# Altium project FallDetection.PrjPcb
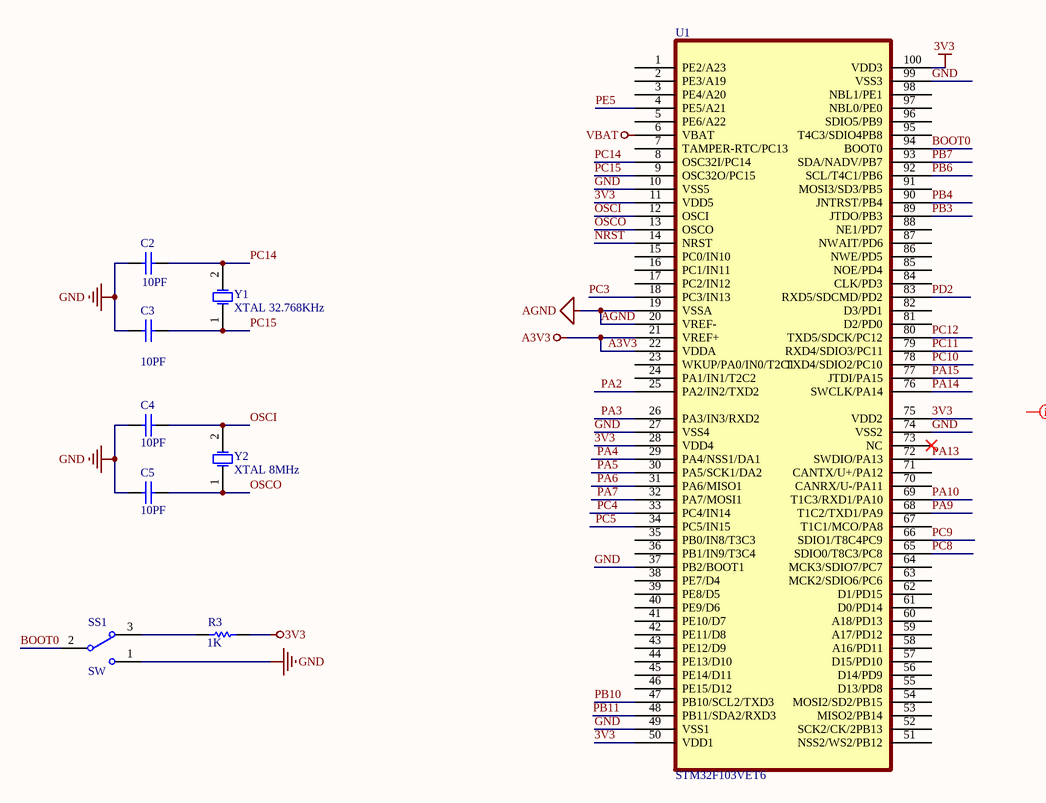
[diagram p0: FallDetection.SchDoc]
4 sheets, 60 parts. Net scope: global (net labels, ports and power ports of the same name join across sheets).
Board file: FallDetection.PcbDoc
Sheets:
  FallDetection.SchDoc
  power.SchDoc
  periphrial.SchDoc
  storage.SchDoc

## Sheet FallDetection.SchDoc: 跌倒检测
size A4

### Parts
C2  10PF  [1608[0603]]
C3  10PF  [1608[0603]]
C4  10PF  [1608[0603]]
C5  10PF  [1608[0603]]
R3  value 1K  [J1-0603]  (hidden comment: Res1)
SS1  SW  [SS-12F44]
U1  STM32F103VET6  [TQFP100-2]
Y1  XTAL 32.768KHz  [XTAL2]
Y2  XTAL 8MHz  [XTAL1]

### Nets
3V3: R3.2 U1.11(VDD5) U1.28(VDD4) U1.50(VDD1) U1.75(VDD2) U1.100(VDD3)
A3V3: U1.21(VREF+) U1.22(VDDA)
AGND: U1.19(VSSA) U1.20(VREF-)
GND: C2.2 C3.2 C4.2 C5.2 SS1.1 U1.10(VSS5) U1.27(VSS4) U1.37(PB2/BOOT1) U1.49(VSS1) U1.74(VSS2) U1.99(VSS3)
VBAT: U1.6(VBAT)
BOOT0: SS1.2 U1.94(BOOT0)
NRST: U1.14(NRST)
OSCI: C4.1 U1.12(OSCI) Y2.2(OSC2)
OSCO: C5.1 U1.13(OSCO) Y2.1(OSC1)
PA2: U1.25(PA2/IN2/TXD2)
PA3: U1.26(PA3/IN3/RXD2)
PA4: U1.29(PA4/NSS1/DA1)
PA5: U1.30(PA5/SCK1/DA2)
PA6: U1.31(PA6/MISO1)
PA7: U1.32(PA7/MOSI1)
PA9: U1.68(T1C2/TXD1/PA9)
PA10: U1.69(T1C3/RXD1/PA10)
PA13: U1.72(SWDIO/PA13)
PA14: U1.76(SWCLK/PA14)
PA15: U1.77(JTDI/PA15)
PB3: U1.89(JTDO/PB3)
PB4: U1.90(JNTRST/PB4)
PB6: U1.92(SCL/T4C1/PB6)
PB7: U1.93(SDA/NADV/PB7)
PB10: U1.47(PB10/SCL2/TXD3)
PB11: U1.48(PB11/SDA2/RXD3)
PC3: U1.18(PC3/IN13)
PC4: U1.33(PC4/IN14)
PC5: U1.34(PC5/IN15)
PC8: U1.65(SDIO0/T8C3/PC8)
PC9: U1.66(SDIO1/T8C4PC9)
PC10: U1.78(TXD4/SDIO2/PC10)
PC11: U1.79(RXD4/SDIO3/PC11)
PC12: U1.80(TXD5/SDCK/PC12)
PC14: C2.1 U1.8(OSC32I/PC14) Y1.2(OSC2)
PC15: C3.1 U1.9(OSC32O/PC15) Y1.1(OSC1)
PD2: U1.83(RXD5/SDCMD/PD2)
PE5: U1.4(PE5/A21)
NetR3_1: R3.1 SS1.3

Not connected (* = marked no-connect by the designer): U1 1(PE2/A23) 2(PE3/A19) 3(PE4/A20) 5(PE6/A22) 7(TAMPER-RTC/PC13) 15(PC0/IN10) 16(PC1/IN11) 17(PC2/IN12) 23(WKUP/PA0/IN0/T2C1) 24(PA1/IN1/T2C2) 35(PB0/IN8/T3C3) 36(PB1/IN9/T3C4) 38(PE7/D4) 39(PE8/D5) 40(PE9/D6) 41(PE10/D7) 42(PE11/D8) 43(PE12/D9) 44(PE13/D10) 45(PE14/D11) 46(PE15/D12) 51(NSS2/WS2/PB12) 52(SCK2/CK/2PB13) 53(MISO2/PB14) 54(MOSI2/SD2/PB15) 55(D13/PD8) 56(D14/PD9) 57(D15/PD10) 58(A16/PD11) 59(A17/PD12) 60(A18/PD13) 61(D0/PD14) 62(D1/PD15) 63(MCK2/SDIO6/PC6) 64(MCK3/SDIO7/PC7) 67(T1C1/MCO/PA8) 70(CANRX/U-/PA11) 71(CANTX/U+/PA12) 73(NC)* 81(D2/PD0) 82(D3/PD1) 84(CLK/PD3) 85(NOE/PD4) 86(NWE/PD5) 87(NWAIT/PD6) 88(NE1/PD7) 91(MOSI3/SD3/PB5) 95(T4C3/SDIO4PB8) 96(SDIO5/PB9) 97(NBL0/PE0) 98(NBL1/PE1)

### Layout directives
net class CPU: (no net found under the mark)

### Notes on the sheet
- Title
- Size:
- Date:
- A4
- Number:
- Time:
- Revision:
- Sheet
- of
- File:

### Library data of the parts
C2 C3 = Cap: Capacitor; Published: 8-Jun-2000; LatestRevisionDate: 17-Jul-2002; LatestRevisionNote: Re-released for DXP Platform.; PackageReference: RAD-0.3; Publisher: Altium Limited; Value: 10PF
C4 C5 = Cap: Capacitor; Value: 0.01uF; Published: 8-Jun-2000; LatestRevisionDate: 17-Jul-2002; LatestRevisionNote: Re-released for DXP Platform.; PackageReference: RAD-0.3; Publisher: Altium Limited
R3 = Res1: Resistor; Published: 8-Jun-2000; LatestRevisionDate: 17-Jul-2002; LatestRevisionNote: Re-released for DXP Platform.; PackageReference: AXIAL-0.3; Publisher: Altium Limited; PackageDescription: Axial Device, Thru-Hole; 2 Leads; 0.3 in Pin Spacing
SS1 = SS-12F44: 拨动开关 SS-12F44 二挡立式 1P2T SS12F44G5 滑动开关
U1 = STM32F103VET6: ST High-density performance line ARM-based 32-bit MCU with 256 to  512KB Flash, USB, CAN, 11 timers, 3 ADCs, 13 communication interfaces
Y1 Y2 = XTAL: Crystal Oscillator; Published: 8-Jun-2000; LatestRevisionDate: 17-Jul-2002; LatestRevisionNote: Re-released for DXP Platform.; PackageReference: R38; Publisher: Altium Limited

## Sheet power.SchDoc
size A4
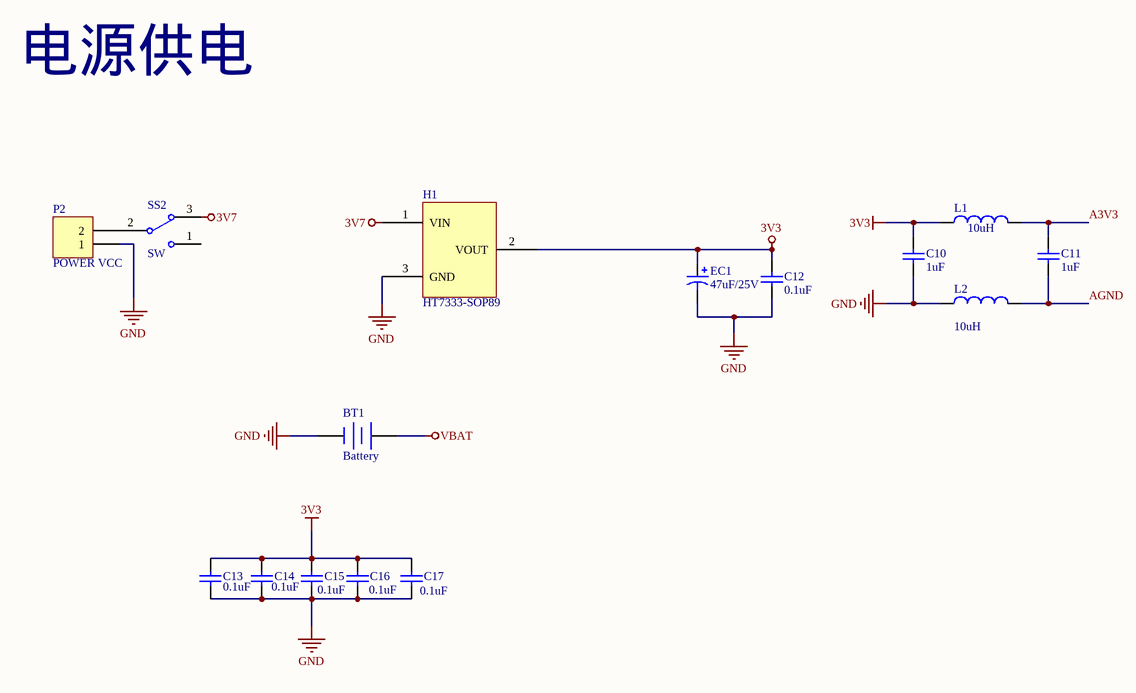
[diagram p1: power.SchDoc]

### Parts
BT1  Battery  [CR1220]
C10  1uF  [1608[0603]]
C11  1uF  [1608[0603]]
C12  value 0.1uF  [1608[0603]]  (hidden comment: Cap)
C13  value 0.1uF  [1608[0603]]  (hidden comment: Cap)
C14  value 0.1uF  [1608[0603]]  (hidden comment: Cap)
C15  value 0.1uF  [1608[0603]]  (hidden comment: Cap)
C16  value 0.1uF  [1608[0603]]  (hidden comment: Cap)
C17  value 0.1uF  [1608[0603]]  (hidden comment: Cap)
EC1  47uF/25V  [47UF 25V SMT Caps]
H1  HT7333-SOP89  [HT7333-SOT89]
L1  10uH  [0805C]
L2  10uH  [0805C]
P2  POWER VCC  [HDR1X2]
SS2  SW  [SS-12F44]

### Nets
3V3: C10.2 C12.1 C13.2 C14.2 C15.2 C16.2 C17.2 EC1.1 H1.2(VOUT) L1.1
3V7: H1.1(VIN) SS2.3
A3V3: C11.2 L1.2
AGND: C11.1 L2.2
GND: BT1.2(-) C10.1 C12.2 C13.1 C14.1 C15.1 C16.1 C17.1 EC1.2 H1.3(GND) L2.1 P2.1
VBAT: BT1.1(+)
NetP2_2: P2.2 SS2.2

Not connected (* = marked no-connect by the designer): SS2 1

### Notes on the sheet
- 电源供电
- Title
- Size:
- Date:
- A4
- Number:
- Time:
- Revision:
- Sheet
- of
- File:

### Library data of the parts
BT1 = Battery: Multicell Battery; Published: 24-Mar-1999; LatestRevisionDate: 17-Jul-2002; LatestRevisionNote: Re-released for DXP Platform.; PackageReference: BAT-2; Publisher: Altium Limited; PackageDescription: Battery; 2 Leads
C10 C11 = Cap: Capacitor; Value: 0.01uF; Published: 8-Jun-2000; LatestRevisionDate: 17-Jul-2002; LatestRevisionNote: Re-released for DXP Platform.; PackageReference: RAD-0.3; Publisher: Altium Limited
C12-C17 = Cap: Capacitor; Published: 8-Jun-2000; LatestRevisionDate: 17-Jul-2002; LatestRevisionNote: Re-released for DXP Platform.; PackageReference: RAD-0.3; Publisher: Altium Limited; PackageDescription: Radial Cap, Thru-Hole; 2 Leads; 0.3 in Pin Spacing
EC1 = Cap Pol1: Polarized Capacitor (Radial); Value: 47uF; Published: 8-Jun-2000; LatestRevisionDate: 17-Jul-2002; LatestRevisionNote: Re-released for DXP Platform.; PackageReference: RB7.6-15; Publisher: Altium Limited; PackageDescription: Polarized Capacitor (Radial); 2 Leads
H1 = HT7333: pin to pad: 1>2 2>3 3>1
L1 L2 = Inductor: Code_IEC: 1005; Published: 8-Jun-2000; LatestRevisionDate: 17-Jul-2002; LatestRevisionNote: Re-released for DXP Platform.; PackageReference: 0402-A; Publisher: Altium Limited; Code_JEITA: 0402; Value: 10uH
P2 = Header 2: Header, 2-Pin; LatestRevisionDate: 17-Jul-2002; LatestRevisionNote: Re-released for DXP Platform.; Publisher: Altium Limited
SS2 = SS-12F44: 拨动开关 SS-12F44 二挡立式 1P2T SS12F44G5 滑动开关

## Sheet periphrial.SchDoc
size A4
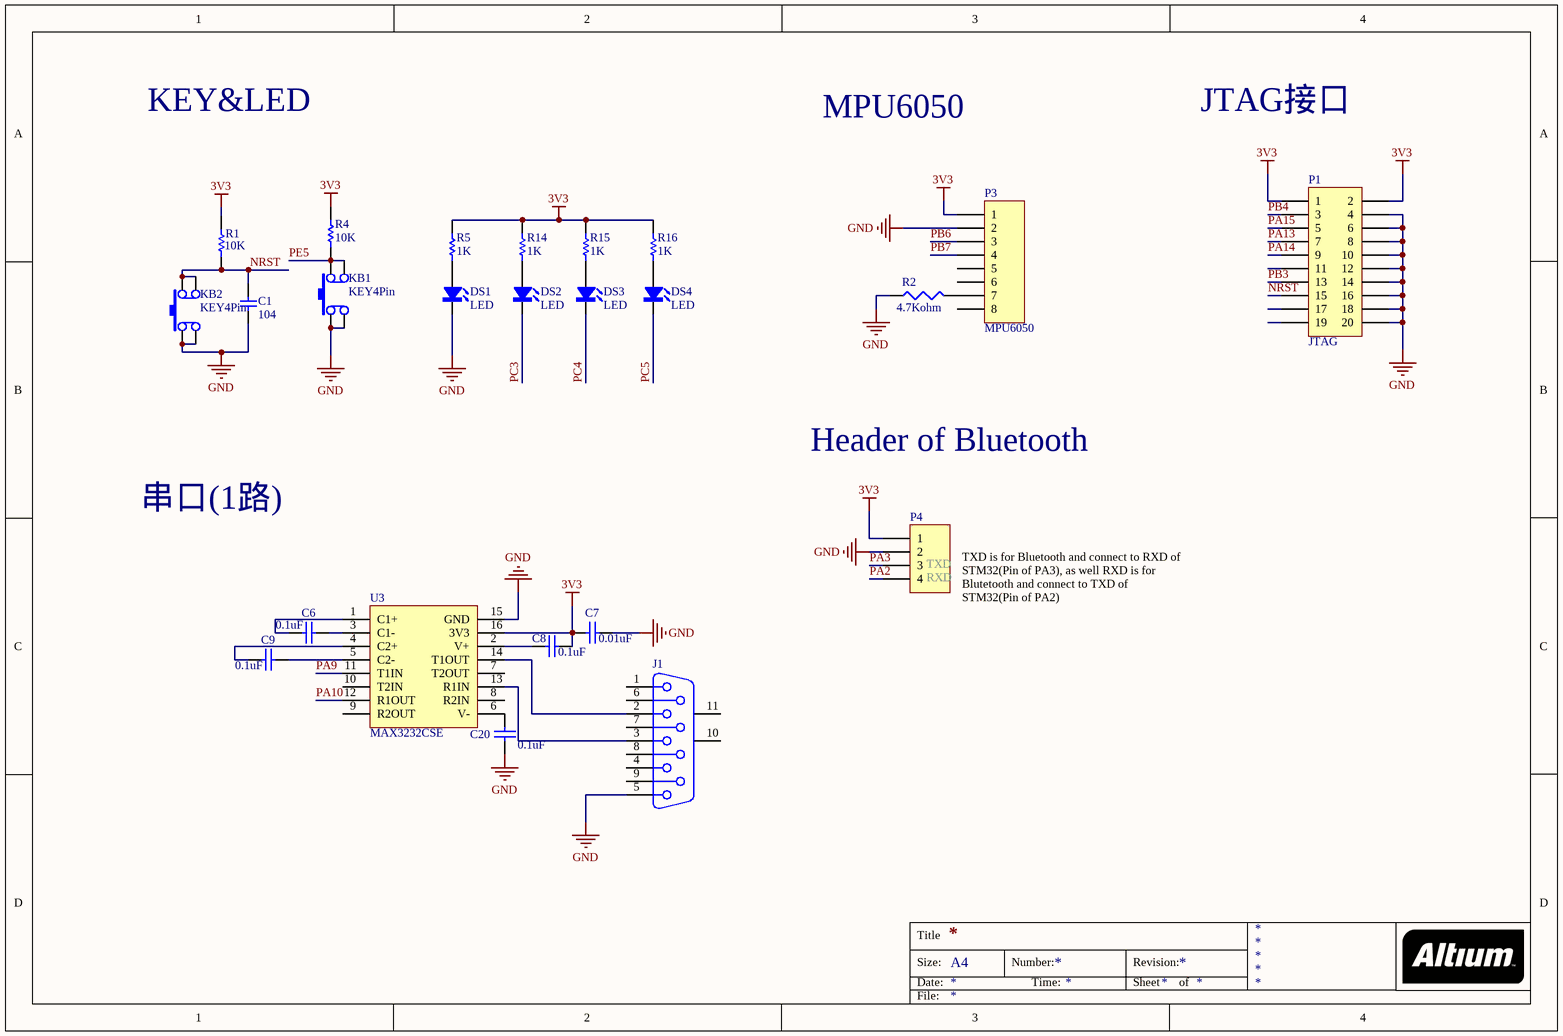
[diagram p2: periphrial.SchDoc]

### Parts
C1  104  [1608[0603]]
C6  value 0.1uF  [1608[0603]]  (hidden comment: Cap)
C7  value 0.01uF  [1608[0603]]  (hidden comment: Cap)
C8  value 0.1uF  [1608[0603]]  (hidden comment: Cap)
C9  value 0.1uF  [1608[0603]]  (hidden comment: Cap)
C20  value 0.1uF  [1608[0603]]  (hidden comment: Cap)
DS1  LED  [0805D]
DS2  LED  [0805D]
DS3  LED  [0805D]
DS4  LED  [0805D]
J1  D Connector 9  [DSUB1.385-2H9]  (value not drawn)
KB1  KEY4Pin  [KEY4Pin]
KB2  KEY4Pin  [KEY4Pin]
P1  JTAG  [HDR2X10]
P3  MPU6050  [HDR1X8]
P4  bluetooth1  [HDR1X4]  (value not drawn)
R1  value 10K  [J1-0603]  (hidden comment: Res1)
R2  value 4.7Kohm  [J1-0603]  (hidden comment: Res1)
R4  value 10K  [J1-0603]  (hidden comment: Res1)
R5  value 1K  [J1-0603]  (hidden comment: Res1)
R14  value 1K  [J1-0603]  (hidden comment: Res1)
R15  value 1K  [J1-0603]  (hidden comment: Res1)
R16  value 1K  [J1-0603]  (hidden comment: Res1)
U3  MAX3232CSE  [MAX3232CSE]

### Nets
3V3: C7.1 C8.1 P1.1 P1.2 P3.1 P4.1 R1.2 R4.2 R5.2 R14.2 R15.2 R16.2 U3.16(3V3)
GND: C1.1 C7.2 C20.2 DS1.K J1.5 KB1.1(T1) KB1.2(T2) KB2.1(T1) KB2.2(T2) P1.4 P1.6 P1.8 P1.10 P1.12 P1.14 P1.16 P1.18 P1.20 P3.2 P4.2 R2.1 U3.15(GND)
NRST: C1.2 KB2.3(T3) KB2.4(T4) P1.15 R1.1
PA2: P4.4
PA3: P4.3
PA9: U3.11(T1IN)
PA10: U3.12(R1OUT)
PA13: P1.7
PA14: P1.9
PA15: P1.5
PB3: P1.13
PB4: P1.3
PB6: P3.3
PB7: P3.4
PC3: DS2.K
PC4: DS3.K
PC5: DS4.K
PE5: KB1.3(T3) KB1.4(T4) R4.1
NetC6_1: C6.1 U3.1(C1+)
NetC6_2: C6.2 U3.3(C1-)
NetC8_2: C8.2 U3.2(V+)
NetC9_1: C9.1 U3.4(C2+)
NetC9_2: C9.2 U3.5(C2-)
NetC20_1: C20.1 U3.6(V-)
NetDS1_A: DS1.A R5.1
NetDS2_A: DS2.A R14.1
NetDS3_A: DS3.A R15.1
NetDS4_A: DS4.A R16.1
NetJ1_2: J1.2 U3.14(T1OUT)
NetJ1_3: J1.3 U3.13(R1IN)
NetP3_7: P3.7 R2.2

Not connected (* = marked no-connect by the designer): J1 1 4 6 7 8 9 10(MH1) 11(MH2); P1 11 17 19; P3 5 6 8; U3 7(T2OUT) 8(R2IN) 9(R2OUT) 10(T2IN)

### Notes on the sheet
- KEY&LED
- JTAG接口
- MPU6050
- 串口(1路)
- Header of Bluetooth
- (near P4) TXD
- (near P4) RXD
- (near P4) TXD is for Bluetooth and connect to RXD of STM32(Pin of PA3), as well RXD is for Blutetooth and connect to TXD of STM32(Pin of PA2)
- Title
- Size:
- Date:
- A4
- Number:
- Time:
- Revision:
- Sheet
- of
- File:

### Library data of the parts
C1 = CAP: Ceramic Capacitor
C6-C9 C20 = Cap: Capacitor; Published: 8-Jun-2000; LatestRevisionDate: 17-Jul-2002; LatestRevisionNote: Re-released for DXP Platform.; PackageReference: RAD-0.3; Publisher: Altium Limited
J1 = D Connector 9: Receptacle Assembly, 9 Position, Right Angle; PackageDocument: O; Positions: 9; Published: 15-Jun-2001; LatestRevisionDate: 17-Jul-2002; LatestRevisionNote: Re-released for DXP Platform.; DatasheetDocument: 1-Sep-1999; PackageReference: 788750; Publisher: Altium Limited; Orientation: Right Angle; Gender: Receptacle
KB1 KB2 = KEY4Pin: pin to pad: 2>4 4>2; REV: *; REF: *; DESIG: *; BOI: *; FAB: *; DEV: *; VAL: *
P1 = Header 10X2: Header, 10-Pin, Dual row; LatestRevisionDate: 17-Jul-2002; LatestRevisionNote: Re-released for DXP Platform.; Publisher: Altium Limited
P3 = Header 8: Header, 8-Pin; LatestRevisionDate: 17-Jul-2002; LatestRevisionNote: Re-released for DXP Platform.; Publisher: Altium Limited
P4 = Header 4: Header, 4-Pin; LatestRevisionDate: 17-Jul-2002; LatestRevisionNote: Re-released for DXP Platform.; Publisher: Altium Limited
R1 R4 R5 R14-R16 = Res1: Resistor; Published: 8-Jun-2000; LatestRevisionDate: 17-Jul-2002; LatestRevisionNote: Re-released for DXP Platform.; PackageReference: AXIAL-0.3; Publisher: Altium Limited; PackageDescription: Axial Device, Thru-Hole; 2 Leads; 0.3 in Pin Spacing
R2 = Res3: Resistor; Published: 8-Jun-2000; LatestRevisionDate: 04-Mar-2005; LatestRevisionNote: PCB Footprint replaced.; PackageReference: J1-0603; Publisher: Altium Limited

## Sheet storage.SchDoc
size A4
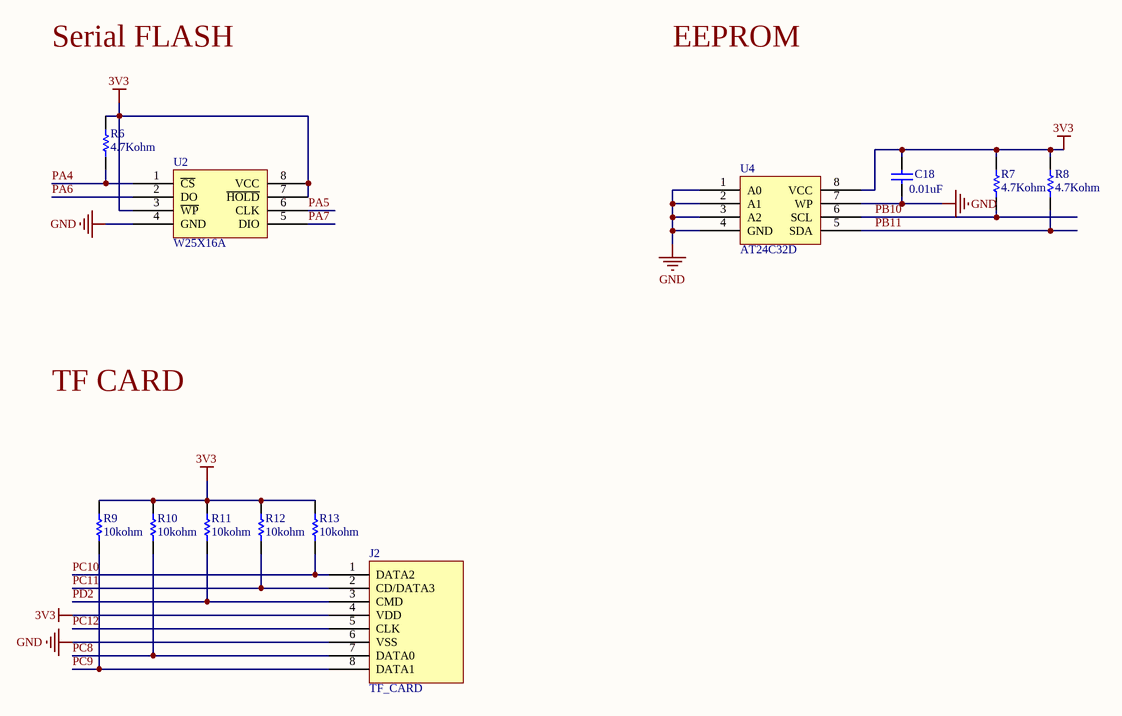
[diagram p3: storage.SchDoc]

### Parts
C18  value 0.01uF  [1608[0603]]  (hidden comment: Cap)
J2  TF_CARD  [MicroSD]
R6  value 4.7Kohm  [J1-0603]  (hidden comment: Res1)
R7  value 4.7Kohm  [J1-0603]  (hidden comment: Res1)
R8  value 4.7Kohm  [J1-0603]  (hidden comment: Res1)
R9  value 10kohm  [J1-0603]  (hidden comment: Res1)
R10  value 10kohm  [J1-0603]  (hidden comment: Res1)
R11  value 10kohm  [J1-0603]  (hidden comment: Res1)
R12  value 10kohm  [J1-0603]  (hidden comment: Res1)
R13  value 10kohm  [J1-0603]  (hidden comment: Res1)
U2  W25X16A  [W25X16A-SOIC127P780X216-8N]
U4  AT24C32D  [AT24C32D-SOIC127P600X175-8N]

### Nets
3V3: C18.2 J2.4(VDD) R6.2 R7.2 R8.2 R9.2 R10.2 R11.2 R12.2 R13.2 U2.3(~{WP}) U2.7(~{HOLD}) U2.8(VCC) U4.8(VCC)
GND: C18.1 J2.6(VSS) U2.4(GND) U4.1(A0) U4.2(A1) U4.3(A2) U4.4(GND) U4.7(WP)
PA4: R6.1 U2.1(~{CS})
PA5: U2.6(CLK)
PA6: U2.2(DO)
PA7: U2.5(DIO)
PB10: R7.1 U4.6(SCL)
PB11: R8.1 U4.5(SDA)
PC8: J2.7(DATA0) R10.1
PC9: J2.8(DATA1) R9.1
PC10: J2.1(DATA2) R13.1
PC11: J2.2(CD/DATA3) R12.1
PC12: J2.5(CLK)
PD2: J2.3(CMD) R11.1

### Notes on the sheet
- Serial FLASH
- EEPROM
- TF CARD
- Title
- Size:
- Date:
- A4
- Number:
- Time:
- Revision:
- Sheet
- of
- File:

### Library data of the parts
C18 = Cap: Capacitor; Published: 8-Jun-2000; LatestRevisionDate: 17-Jul-2002; LatestRevisionNote: Re-released for DXP Platform.; PackageReference: RAD-0.3; Publisher: Altium Limited; PackageDescription: Radial Cap, Thru-Hole; 2 Leads; 0.3 in Pin Spacing
R6-R13 = Res1: Resistor; Published: 8-Jun-2000; LatestRevisionDate: 17-Jul-2002; LatestRevisionNote: Re-released for DXP Platform.; PackageReference: AXIAL-0.3; Publisher: Altium Limited; PackageDescription: Axial Device, Thru-Hole; 2 Leads; 0.3 in Pin Spacing
U2 = W25X16A: W25X16A, Serial Flash, 16M-bit, 2M-Byte
U4 = AT24C32D: EEPROM, 32K

## Nets that join several sheets
3V3: FallDetection (6 pins), power (10 pins), periphrial (13 pins), storage (14 pins)
A3V3: FallDetection (U1.21 U1.22), power (C11.2 L1.2)
AGND: FallDetection (U1.19 U1.20), power (C11.1 L2.2)
GND: FallDetection (11 pins), power (12 pins), periphrial (22 pins), storage (8 pins)
VBAT: FallDetection (U1.6), power (BT1.1)
NRST: FallDetection (U1.14), periphrial (5 pins)
PA2: FallDetection (U1.25), periphrial (P4.4)
PA3: FallDetection (U1.26), periphrial (P4.3)
PA4: FallDetection (U1.29), storage (R6.1 U2.1)
PA5: FallDetection (U1.30), storage (U2.6)
PA6: FallDetection (U1.31), storage (U2.2)
PA7: FallDetection (U1.32), storage (U2.5)
PA9: FallDetection (U1.68), periphrial (U3.11)
PA10: FallDetection (U1.69), periphrial (U3.12)
PA13: FallDetection (U1.72), periphrial (P1.7)
PA14: FallDetection (U1.76), periphrial (P1.9)
PA15: FallDetection (U1.77), periphrial (P1.5)
PB3: FallDetection (U1.89), periphrial (P1.13)
PB4: FallDetection (U1.90), periphrial (P1.3)
PB6: FallDetection (U1.92), periphrial (P3.3)
PB7: FallDetection (U1.93), periphrial (P3.4)
PB10: FallDetection (U1.47), storage (R7.1 U4.6)
PB11: FallDetection (U1.48), storage (R8.1 U4.5)
PC3: FallDetection (U1.18), periphrial (DS2.K)
PC4: FallDetection (U1.33), periphrial (DS3.K)
PC5: FallDetection (U1.34), periphrial (DS4.K)
PC8: FallDetection (U1.65), storage (J2.7 R10.1)
PC9: FallDetection (U1.66), storage (J2.8 R9.1)
PC10: FallDetection (U1.78), storage (J2.1 R13.1)
PC11: FallDetection (U1.79), storage (J2.2 R12.1)
PC12: FallDetection (U1.80), storage (J2.5)
PD2: FallDetection (U1.83), storage (J2.3 R11.1)
PE5: FallDetection (U1.4), periphrial (KB1.3 KB1.4 R4.1)